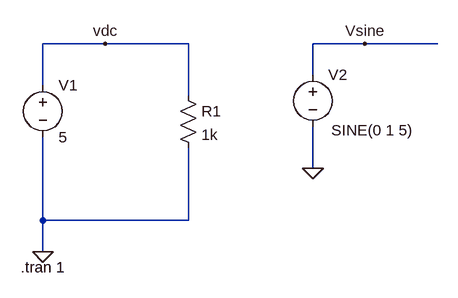
[diagram p0: schematic Draft1.asc]
Draft1.asc, the LTspice schematic file:
Version 4
SHEET 1 880 680
WIRE 144 80 48 80
WIRE 272 80 144 80
WIRE 544 80 464 80
WIRE 656 80 544 80
WIRE 464 128 464 80
WIRE 48 144 48 80
WIRE 272 160 272 80
WIRE 464 272 464 208
WIRE 48 352 48 224
WIRE 272 352 272 240
WIRE 272 352 48 352
WIRE 48 400 48 352
FLAG 48 400 0
FLAG 144 80 vdc
FLAG 464 272 0
FLAG 544 80 Vsine
SYMBOL voltage 48 128 R0
WINDOW 123 0 0 Left 0
WINDOW 39 0 0 Left 0
SYMATTR InstName V1
SYMATTR Value 5
SYMBOL res 256 144 R0
SYMATTR InstName R1
SYMATTR Value 1k
SYMBOL voltage 464 112 R0
WINDOW 3 28 101 Left 2
WINDOW 123 0 0 Left 0
WINDOW 39 0 0 Left 0
SYMATTR InstName V2
SYMATTR Value SINE(0 1 5)
TEXT 14 424 Left 2 !.tran 1

The netlist it stands for:
* Draft1.asc
V1 vdc 0 5
R1 vdc 0 1k
V2 Vsine 0 SINE(0 1 5)
.tran 1
.backanno
.end

* Results of the author's LTspice run, read from the files saved beside the schematic
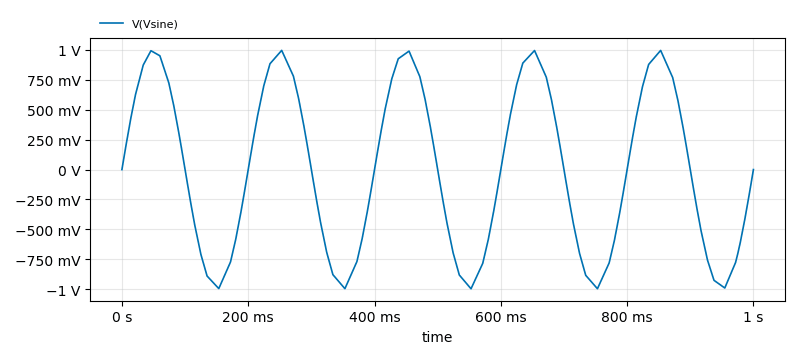
[diagram p1: Transient Analysis of Draft1.asc, plotted from the saved traces]
* Transient Analysis, 1 run:
*   V(Vsine): min -995.4 mV, max 994.9 mV, average 394.4 µV, rms 697 mV, last 0 V